# EAGLE design SX70_proto-flash-card (EAGLE 9.4.2)
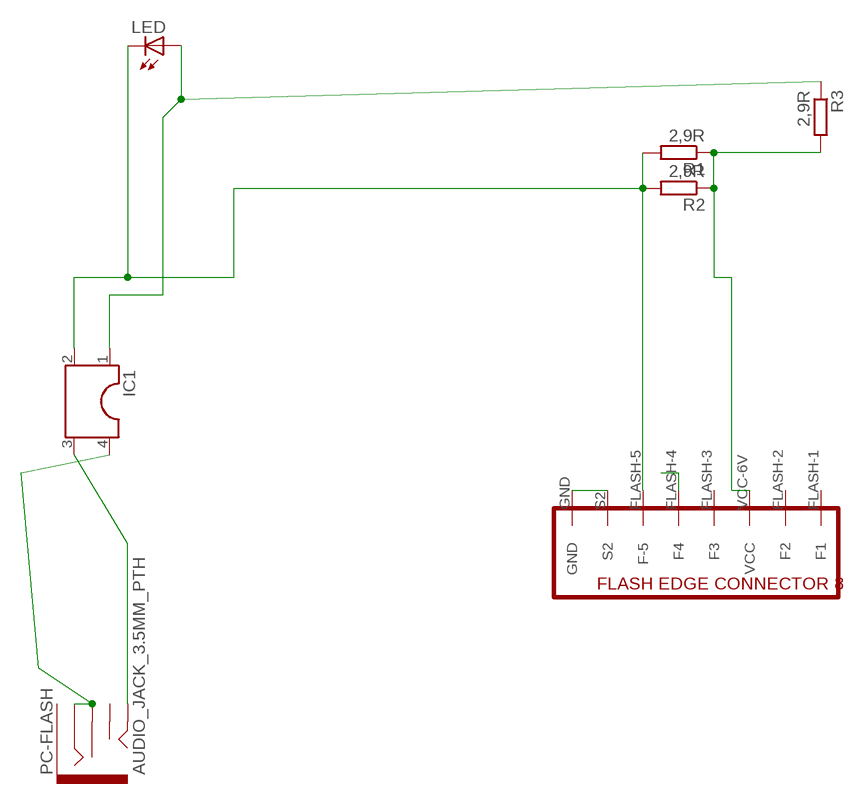
[diagram p0: schematic, sheet 1]

## Parts
FLASH-TESTER  SX70-FLASH-EDGE8-MALE  [SX70-FLASH-EDGE8]
IC1  DIL4  [DIL04]
LED  LED3MM  [LED3MM]
PC-FLASH  AUDIO_JACK_3.5MM_PTH  [AUDIO-JACK]
R1  2,9R  R-EU_0204/7  [0204/7]
R2  2,9R  R-EU_0204/7  [0204/7]
R3  2,9R  R-EU_0204/7  [0204/7]

## Nets
N$1: FLASH-TESTER.GND FLASH-TESTER.S2
N$5: FLASH-TESTER.FLASH-5(F-5) IC1.2 LED.K(C) R1.2 R2.2
N$7: FLASH-TESTER.VCC-6V(VCC) R1.1 R2.1 R3.2
N$8: IC1.1 LED.A R3.1
N$9: FLASH-TESTER.FLASH-4(F4)
N$11: IC1.4 PC-FLASH.RING PC-FLASH.RSH
N$12: IC1.3 PC-FLASH.TIP
Unconnected: FLASH-TESTER.FLASH-1(F1) FLASH-TESTER.FLASH-2(F2) FLASH-TESTER.FLASH-3(F3) PC-FLASH.SLEEVE PC-FLASH.TSH

## Library data of the parts
FLASH-TESTER = openSX70:SX70-FLASH-EDGE8-MALE
IC1 = ic-package:DIL4: Dual In Line / Socket
LED = adafruit:LED: LED OSRAM: - CHIPLED LG R971, LG N971, LY N971, LG Q971, LY Q971, LO R971, LY R971 LH N974, LH R974 LS Q976, LO Q976, LY Q976 LO Q996 - Hyper CHIPLED LW Q18S LB Q993, LB Q99A, LB R99A - SideLED LS A670, LO A670, LY A670, LG A670, LP A670 LB A673, LV A673, LT A673, LW A673 LH A674 LY A675 LS A676, LA A676, LO A676, LY A676, LW A676 LS A679, LY A679, LG A679 - Hyper Micro SIDELED® LS Y876, LA Y876, LO Y876, LY Y876 LT Y87S - SmartLED LW L88C, LW L88S LB L89C, LB L89S, LG L890 LS L89K, LO L89K, LY L89K LS L896, LA L896, LO L896, LY L896 - TOPLED LS T670, LO T670, LY T670, LG T670, LP T670 LSG T670, LSP T670, LSY T670, LOP T670, LYG T670 LG T671, LOG T671, LSG T671 LB T673, LV T673, LT T673, LW T673 LH T674 LS T676, LA T676, LO T676, LY T676, LB T676, LH T676, LSB T676, LW T676 LB T67C, LV T67C, LT T67C, LS T67K, LO T67K, LY T67K, LW E67C LS E67B, LA E67B, LO E67B, LY E67B, LB E67C, LV E67C, LT E67C LW T67C LS T679, LY T679, LG T679 LS T770, LO T770, LY T770, LG T770, LP T770 LB T773, LV T773, LT T773, LW T773 LH T774 LS E675, LA E675, LY E675, LS T675 LS T776, LA T776, LO T776, LY T776, LB T776 LHGB T686 LT T68C, LB T68C - Hyper Mini TOPLED® LB M676 - Mini TOPLED Santana® LG M470 LS M47K, LO M47K, LY M47K Source: http://www.osram.convergy.de/
PC-FLASH = SparkFun-Connectors:AUDIO_JACK_3.5MM: Audio Jack 3.5mm variants of PTH and SMT stereo audio jack with bypass switches. SparkFun Products: SparkFun SparkPunk Sound Kit <[https://www.sparkfun.com/products/11177]> - PTH MP3 Trigger <https://www.sparkfun.com/products/13720> -3.5mm SMD SparkFun PicoBoard <https://www.sparkfun.com/products/11888>- 2.5mm SMD; PROD_ID: CONN-08774; SF_ID: PRT-08032
R1-R3 = rcl:R-EU_: RESISTOR, European symbol

## Board
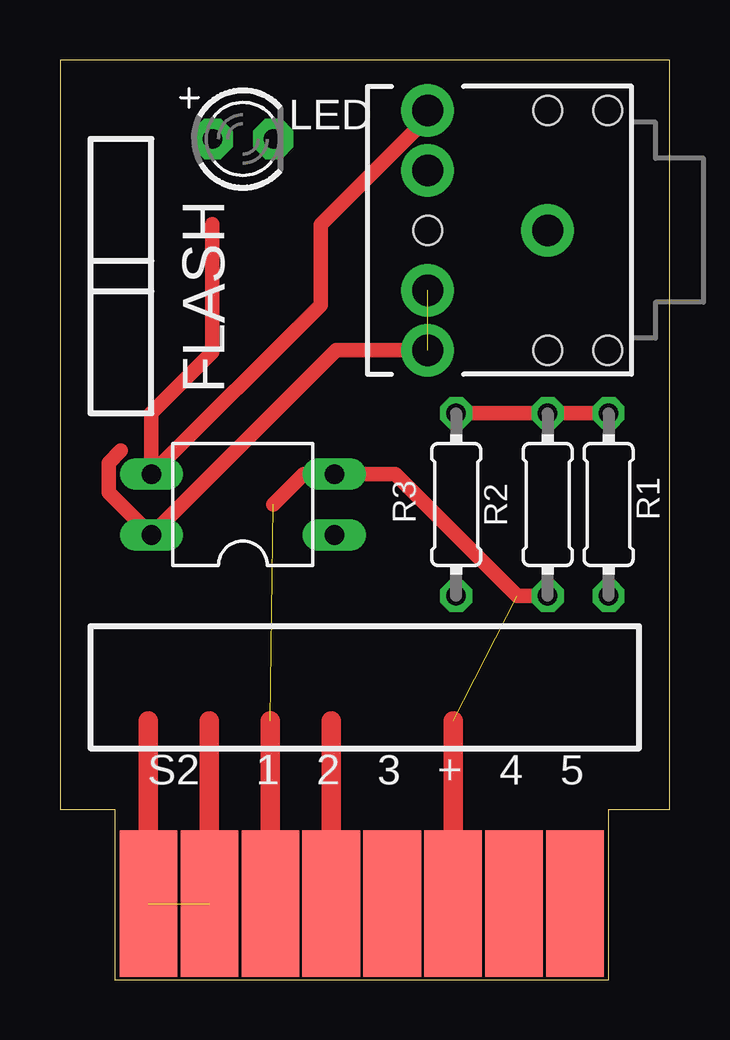
[diagram p1: board, top side]
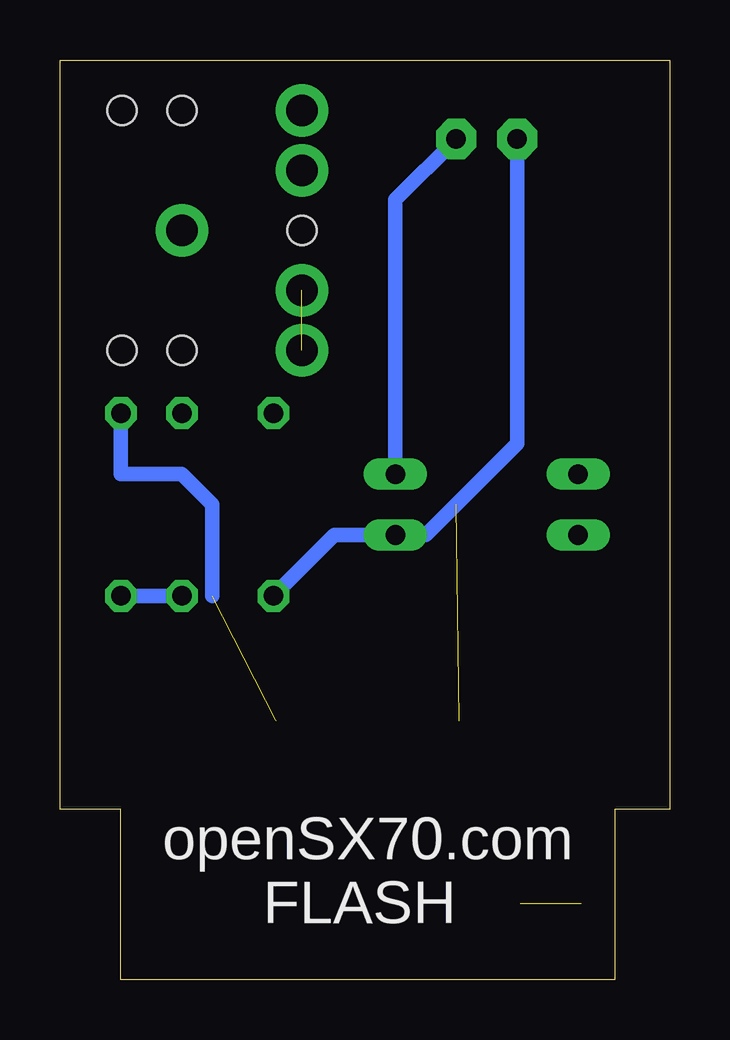
[diagram p2: board, bottom side, seen from below]

Size 25.4 x 38.34 mm. Coordinates in mm from the lower left corner, seen from the top.
Outline: 2.29,0 22.86,0 22.86,7.11 25.4,7.11 25.4,38.34 0,38.34 0,7.11 2.29,7.11 2.29,0
Copper layers (1*16): Top 0.035mm / dielectric 1.5mm / Bottom 0.035mm
Design rules "default": minimum track width 6mil, minimum drill 0.35mm, track to track 6mil, track to pad 6mil, pad to pad 6mil, via to via 6mil, smd to smd 6mil, copper to edge 40mil, drill to drill 6mil, minimum pad ring 10mil, minimum via ring 8mil, stop-mask expansion 4mil, vias tented up to drill 0mil, thermal gap 10mil

### Footprints (pad centres in the part's own frame; a part is rotated, then mirrored left to right if it is on the bottom)
SX70-FLASH-EDGE8 = smd 2.4 x 6.09: FLASH-1 8.89,0.001; FLASH-2 6.35,0.001; FLASH-3 1.27,0.001; FLASH-4 -1.27,0.001; FLASH-5 -3.81,0.001; GND -8.89,0.001; S2 -6.35,0.001; VCC-6V 3.81,0.001
DIL04 = drill 0.813 long: 1 -1.27,-3.81; 2 1.27,-3.81; 3 1.27,3.81; 4 -1.27,3.81
LED3MM = drill 0.813 pad 1.676 octagon: A -1.27,0; K 1.27,0
AUDIO-JACK = drill 1.3 pad 2.184: RING 5,5; RSH 5,2.5; SLEEVE 0,0; TIP 5,-5; TSH 5,-2.5 | hole 1.2: 0,5; -2.5,5; -2.5,-5; 0,-5; 5,0
0204/7 = drill 0.813 octagon: 1 -3.81,0; 2 3.81,0

### Placement (x,y rotation side)
FLASH-TESTER  12.57,3.17 0 top
IC1  7.62,19.81 90 top
LED  7.62,35.05 0 top
PC-FLASH  20.32,31.24 180 top
R1  22.86,19.81 270 top
R2  20.32,19.81 270 top
R3  16.51,19.81 90 top

### Tracks (layer width: path | path; a pad name or v marks a point on that pad's centre or on a via)
N$1  (1 unrouted)
  Top 0.813: FLASH-TESTER.GND 3.68,10.79 | FLASH-TESTER.S2 6.22,10.79
N$5  (1 unrouted)
  Top 0.61: 8.89,19.81 10.16,21.08 IC1.2 13.97,21.08 19.05,16 R2.2
  Top 0.813: FLASH-TESTER.FLASH-5 8.76,10.79
  Bottom 0.61: LED.K 11.43,32.51 IC1.2 | R1.2 R2.2
N$7  (1 unrouted)
  Top 0.61: R3.2 R2.1 R1.1
  Top 0.813: FLASH-TESTER.VCC-6V 16.38,10.79
  Bottom 0.61: 19.05,16 19.05,19.81 20.32,21.08 22.86,21.08 R1.1
N$8
  Bottom 0.61: LED.A 6.35,22.35 10.16,18.54 IC1.1 13.97,18.54 R3.1
N$9
  Top 0.152: 11.28,6.1 11.28,3.2 FLASH-TESTER.FLASH-4
  Top 0.813: FLASH-TESTER.FLASH-4 11.3,10.79
N$11  (1 unrouted)
  Top 0.61: PC-FLASH.RING 11.51,26.24 IC1.4 2.03,20.32 2.03,21.55 2.54,22.05
N$12
  Top 0.61: PC-FLASH.TIP 15.32,35.93 10.86,31.47 10.86,28.13 IC1.3 3.81,23.62 6.35,26.16 6.35,31.5

### Text on the board
tPlace: FLASH
bPlace: openSX70.com / FLASH
tNames: S2 | 1 | 2 | 3 | + | 4 | 5